# EAGLE design ESP12+mosfet+1117 (EAGLE 7.6.0)
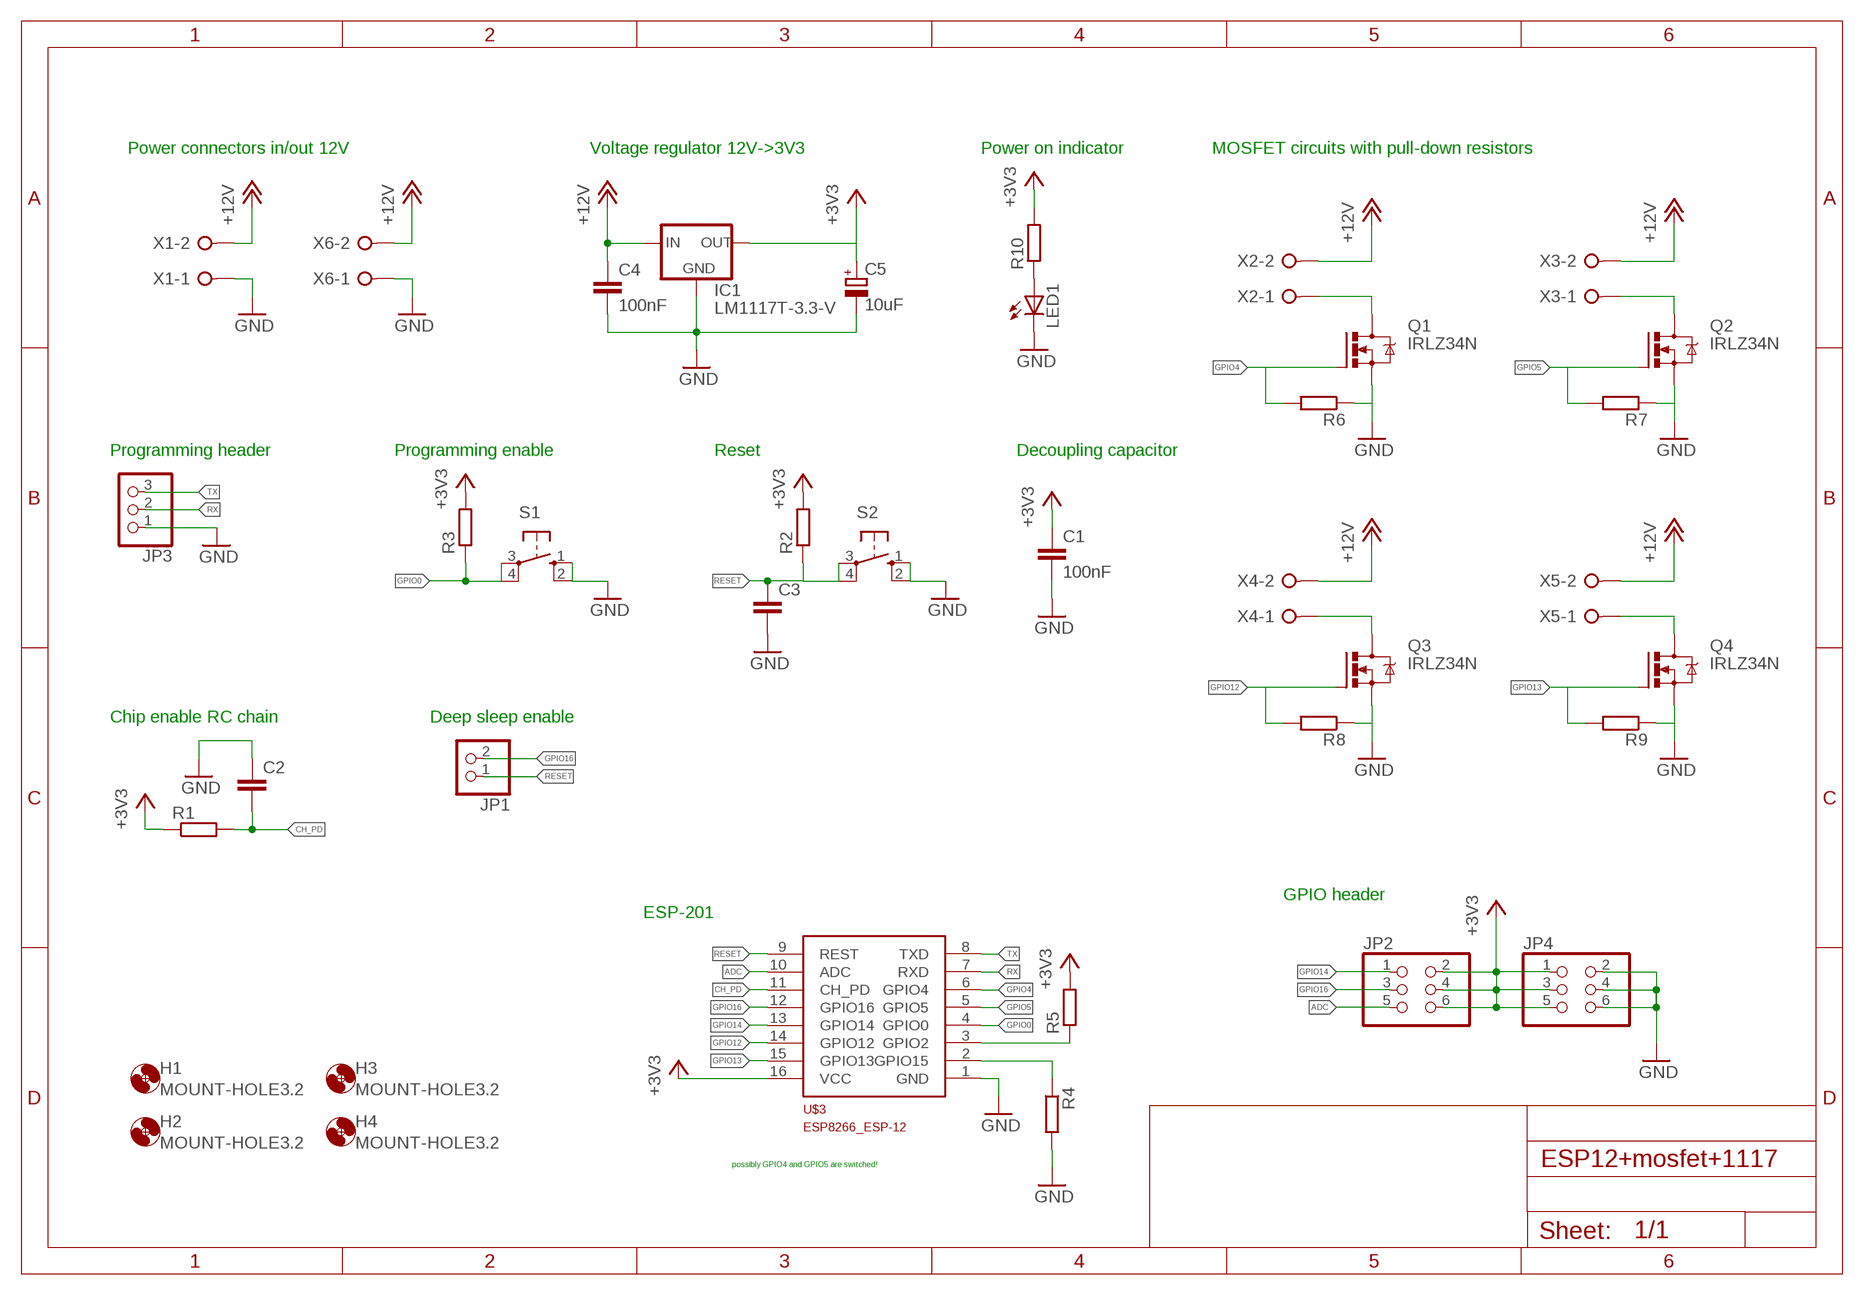
[diagram p0: schematic, sheet 1]

## Parts
C1  100nF  C-EUC0805  [C0805]
C2  C-EUC0805  [C0805]
C3  C-EUC0805  [C0805]
C4  100nF  C-EUC0805  [C0805]
C5  10uF  CPOL-EUE2-4  [E2-4]
H1  MOUNT-HOLE3.2  [3,2]
H2  MOUNT-HOLE3.2  [3,2]
H3  MOUNT-HOLE3.2  [3,2]
H4  MOUNT-HOLE3.2  [3,2]
IC1  LM1117T-3.3-V  [TO220V]
JP1  PINHD-1X2  [1X02]
JP2  PINHD-2X3  [2X03]
JP3  PINHD-1X3  [1X03]
JP4  PINHD-2X3  [2X03]
LED1  LED3MM  [LED3MM]
Q1  IRLZ34N  IRLZ44ZTO220BV  [TO220BV]
Q2  IRLZ34N  IRLZ44ZTO220BV  [TO220BV]
Q3  IRLZ34N  IRLZ44ZTO220BV  [TO220BV]
Q4  IRLZ34N  IRLZ44ZTO220BV  [TO220BV]
R1  R-EU_R0805  [R0805]
R2  R-EU_R0805  [R0805]
R3  R-EU_R0805  [R0805]
R4  R-EU_R0805  [R0805]
R5  R-EU_R0805  [R0805]
R6  R-EU_R0805  [R0805]
R7  R-EU_R0805  [R0805]
R8  R-EU_R0805  [R0805]
R9  R-EU_R0805  [R0805]
R10  R-EU_0207/10  [0207/10]
S1  10-XX  [B3F-10XX]
S2  10-XX  [B3F-10XX]
U$3  ESP8266_ESP-12  [ESP8266-ESP12]
X1  W237-02P  [W237-132]
X2  W237-02P  [W237-132]
X3  W237-02P  [W237-132]
X4  W237-02P  [W237-132]
X5  W237-02P  [W237-132]
X6  W237-02P  [W237-132]

## Nets
+3V3: C1.1 C5.+ IC1.2(OUT) JP2.2 JP2.4 JP2.6 JP4.1 JP4.3 JP4.5 R1.1 R2.2 R3.2 R5.2 R10.2 U$3.16(VCC)
+12V: C4.1 IC1.3(IN) X1.2 X2.2 X3.2 X4.2 X5.2 X6.2
ADC: JP2.5 U$3.10(ADC)
CH_PD: C2.2 R1.2 U$3.11(CH_PD)
GND: C1.2 C2.1 C3.2 C4.2 C5.- IC1.1(GND) JP3.1 JP4.2 JP4.4 JP4.6 LED1.K(C) Q1.S Q2.S Q3.S Q4.S R4.2 R6.1 R7.1 R8.1 R9.1 S1.1(S) S1.2(S1) S2.1(S) S2.2(S1) U$3.1(GND) X1.1 X6.1
GPIO0: R3.1 S1.3(P) S1.4(P1) U$3.4(GPIO0)
GPIO1: R5.1 U$3.3(GPIO2)
GPIO4: Q1.G R6.2 U$3.6(GPIO4)
GPIO5: Q2.G R7.2 U$3.5(GPIO5)
GPIO12: Q3.G R8.2 U$3.14(GPIO12)
GPIO13: Q4.G R9.2 U$3.15(GPIO13)
GPIO14: JP2.1 U$3.13(GPIO14)
GPIO15: R4.1 U$3.2(GPIO15)
GPIO16: JP1.2 JP2.3 U$3.12(GPIO16)
N$1: LED1.A R10.1
N$2: Q1.D X2.1
N$3: Q2.D X3.1
N$4: Q3.D X4.1
N$5: Q4.D X5.1
RESET: C3.1 JP1.1 R2.1 S2.3(P) S2.4(P1) U$3.9(REST)
RX: JP3.2 U$3.7(RXD)
TX: JP3.3 U$3.8(TXD)

## Notes on the sheet
- Power connectors in/out 12V | Voltage regulator 12V->3V3 | Power on indicator | MOSFET circuits with pull-down resistors
- Programming header | Programming enable | Reset | Decoupling capacitor
- Chip enable RC chain | Deep sleep enable
- GPIO header
- ESP-201
- possibly GPIO4 and GPIO5 are switched!

## Library data of the parts
C1-C4 = rcl:C-EU: CAPACITOR, European symbol
C5 = resistor:CPOL-EU: POLARIZED CAPACITOR, European symbol
H1-H4 = holes:MOUNT-HOLE: MOUNTING HOLE with drill center marker
IC1 = lm1117:LM1117T-*
JP1 = pinhead:PINHD-1X2: PIN HEADER
JP2 JP4 = pinhead:PINHD-2X3: PIN HEADER
JP3 = pinhead:PINHD-1X3: PIN HEADER
LED1 = led:LED: LED OSRAM: - CHIPLED LG R971, LG N971, LY N971, LG Q971, LY Q971, LO R971, LY R971 LH N974, LH R974 LS Q976, LO Q976, LY Q976 LO Q996 - Hyper CHIPLED LW Q18S LB Q993, LB Q99A, LB R99A - SideLED LS A670, LO A670, LY A670, LG A670, LP A670 LB A673, LV A673, LT A673, LW A673 LH A674 LY A675 LS A676, LA A676, LO A676, LY A676, LW A676 LS A679, LY A679, LG A679 - Hyper Micro SIDELED® LS Y876, LA Y876, LO Y876, LY Y876 LT Y87S - SmartLED LW L88C, LW L88S LB L89C, LB L89S, LG L890 LS L89K, LO L89K, LY L89K LS L896, LA L896, LO L896, LY L896 - TOPLED LS T670, LO T670, LY T670, LG T670, LP T670 LSG T670, LSP T670, LSY T670, LOP T670, LYG T670 LG T671, LOG T671, LSG T671 LB T673, LV T673, LT T673, LW T673 LH T674 LS T676, LA T676, LO T676, LY T676, LB T676, LH T676, LSB T676, LW T676 LB T67C, LV T67C, LT T67C, LS T67K, LO T67K, LY T67K, LW E67C LS E67B, LA E67B, LO E67B, LY E67B, LB E67C, LV E67C, LT E67C LW T67C LS T679, LY T679, LG T679 LS T770, LO T770, LY T770, LG T770, LP T770 LB T773, LV T773, LT T773, LW T773 LH T774 LS E675, LA E675, LY E675, LS T675 LS T776, LA T776, LO T776, LY T776, LB T776 LHGB T686 LT T68C, LB T68C - Hyper Mini TOPLED® LB M676 - Mini TOPLED Santana® LG M470 LS M47K, LO M47K, LY M47K Source: http://www.osram.convergy.de LUXEON: - LUMILED® LXK2-PW12-R00, LXK2-PW12-S00, LXK2-PW14-U00, LXK2-PW14-V00 LXK2-PM12-R00, LXK2-PM12-S00, LXK2-PM14-U00 LXK2-PE12-Q00, LXK2-PE12-R00, LXK2-PE12-S00, LXK2-PE14-T00, LXK2-PE14-U00 LXK2-PB12-K00, LXK2-PB12-L00, LXK2-PB12-M00, LXK2-PB14-N00, LXK2-PB14-P00, LXK2-PB14-Q00 LXK2-PR12-L00, LXK2-PR12-M00, LXK2-PR14-Q00, LXK2-PR14-R00 LXK2-PD12-Q00, LXK2-PD12-R00, LXK2-PD12-S00 LXK2-PH12-R00, LXK2-PH12-S00 LXK2-PL12-P00, LXK2-PL12-Q00, LXK2-PL12-R00 Source: www.luxeon.com KINGBRIGHT: KA-3528ASYC Source: www.kingbright.com
Q1-Q4 = transistor-power:IRLZ44Z: N-Channel HEXFET® Power MOSFET Logic Level AUTOMOTIVE MOSFET Source: http://www.irf.com/product-info/datasheets/data/irlz44zpbf.pdf
R1-R10 = resistor:R-EU_: RESISTOR, European symbol
S1 S2 = switch-omron:10-XX: OMRON SWITCH; MPN: B3F-1000; OC_FARNELL: 176432; OC_NEWARK: 36M3542
U$3 = ESP8266-ESP12:ESP8266_ESP-12
X1-X6 = con-wago-508:W237-02P: WAGO SREW CLAMP; OC_FARNELL: unknown; OC_NEWARK: unknown

## Board
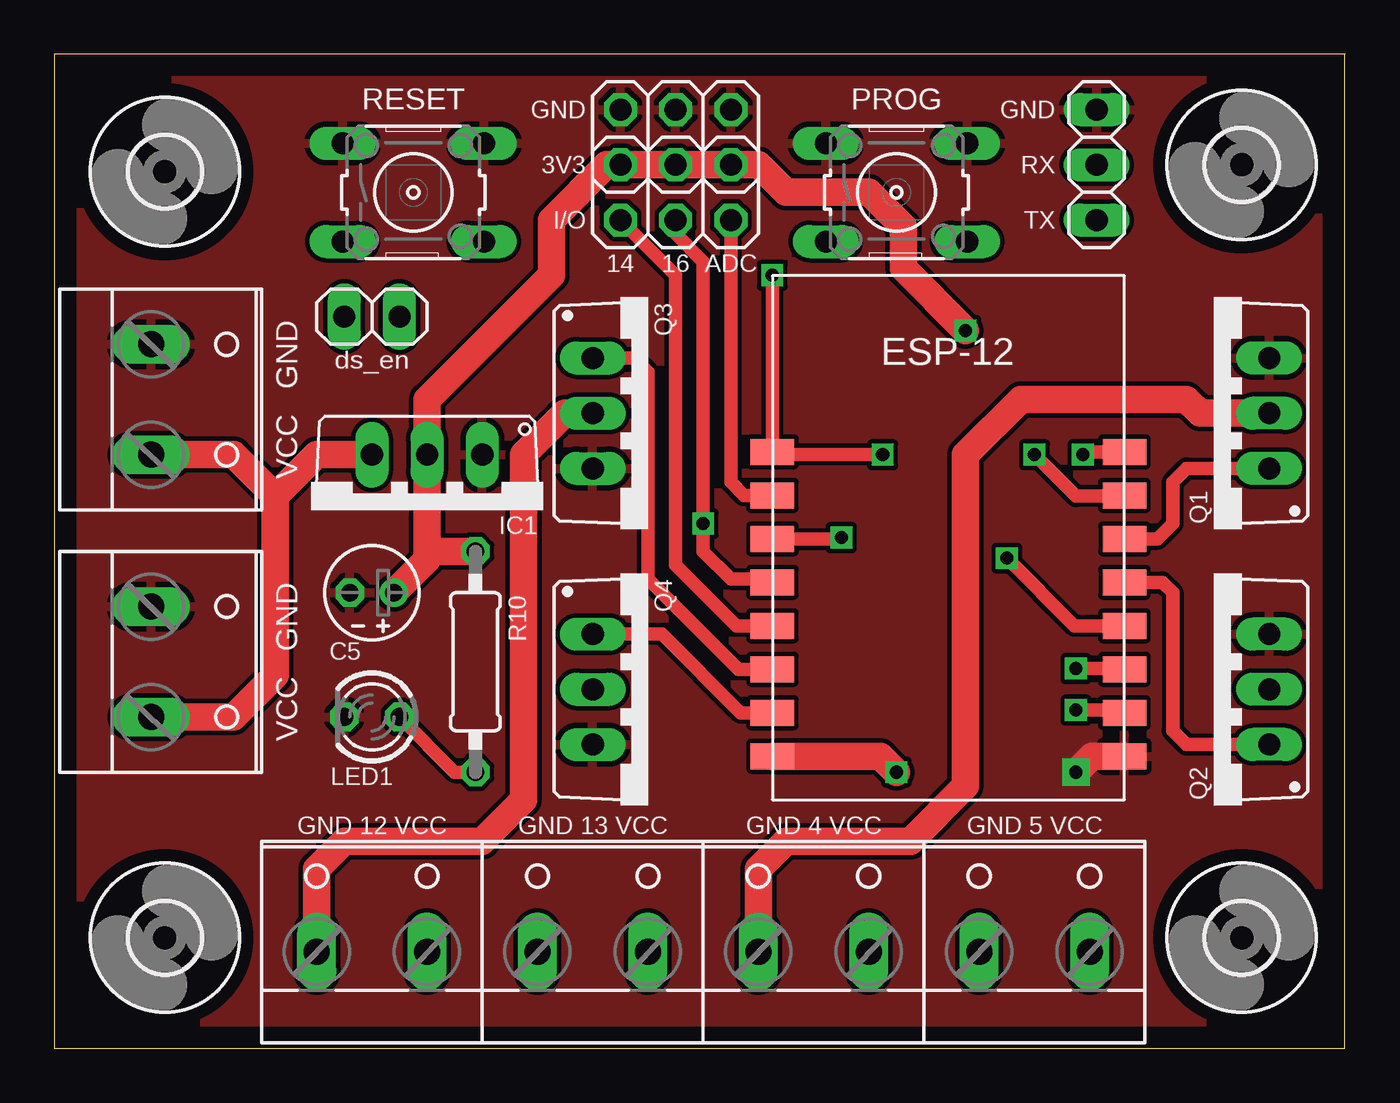
[diagram p1: board, top side]
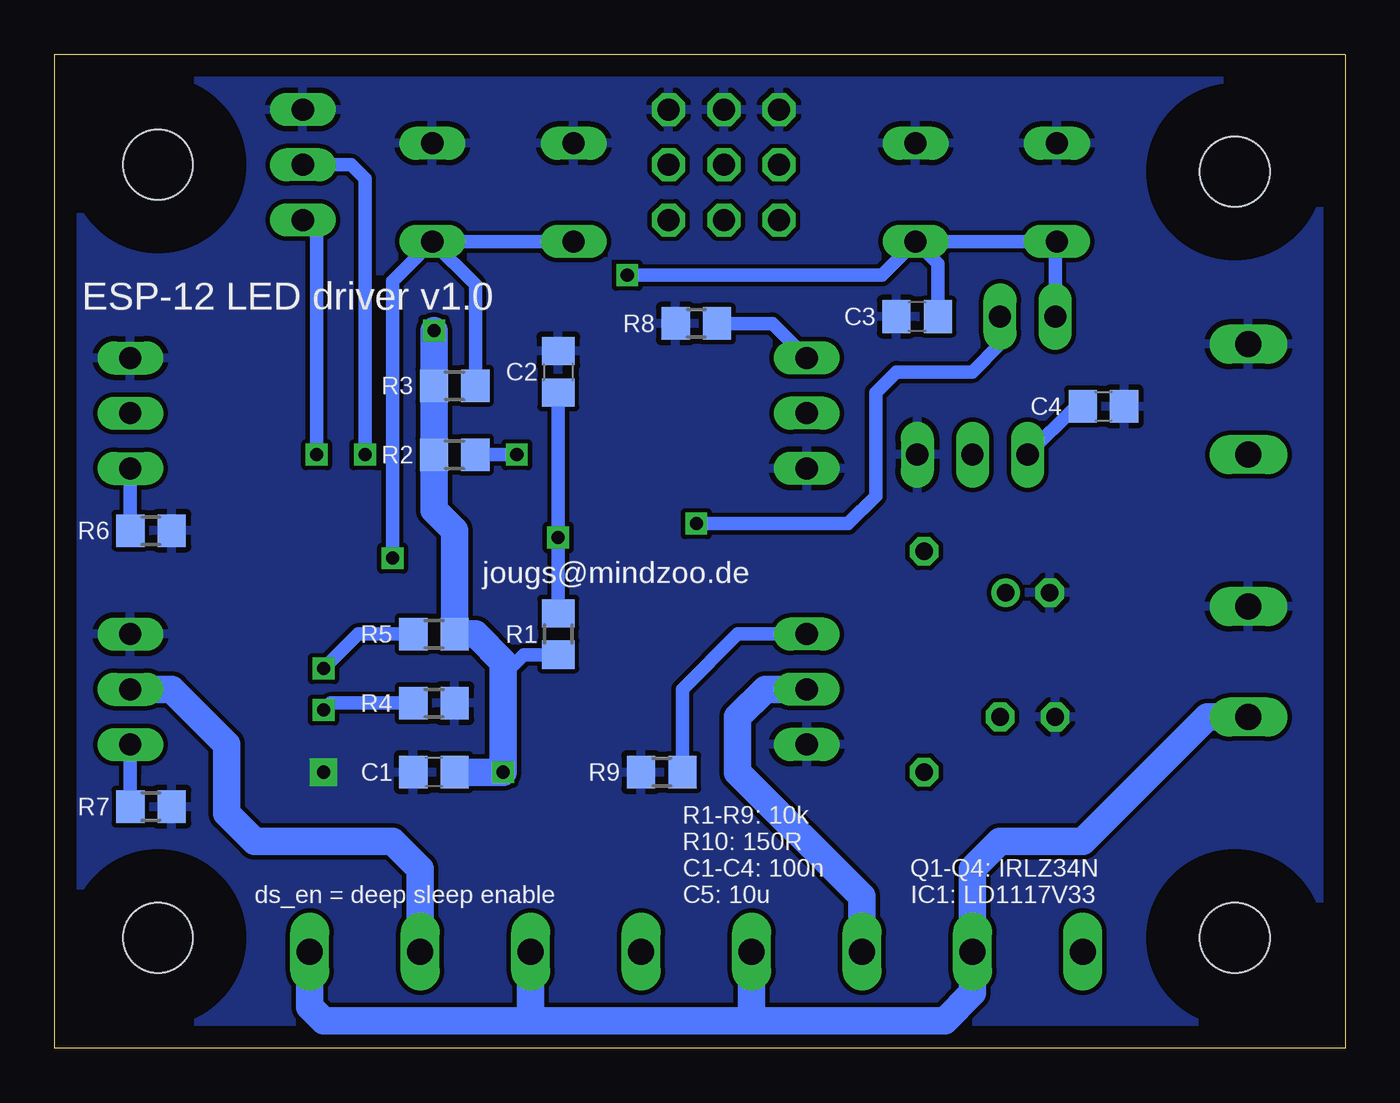
[diagram p2: board, bottom side, seen from below]

Size 59.37 x 45.72 mm. Coordinates in mm from the lower left corner, seen from the top.
Outline: 59.36,45.71 59.36,0 0,0 0,45.71
Outline: 59.37,45.72 0,45.72
Copper layers (1*16): Top 0.035mm / dielectric 1.5mm / Bottom 0.035mm
Design rules "default": minimum track width 10mil, minimum drill 24mil, track to track 8mil, track to pad 8mil, pad to pad 8mil, via to via 8mil, smd to smd 8mil, copper to edge 40mil, drill to drill 8mil, minimum pad ring 10mil, minimum via ring 8mil, stop-mask expansion 4mil, vias tented up to drill 0mil, thermal gap 10mil

### Footprints (pad centres in the part's own frame; a part is rotated, then mirrored left to right if it is on the bottom)
C0805 = smd 1.3 x 1.5: 1 -0.95,0; 2 0.95,0
E2-4 = drill 0.813 pad 1.27: + -1.016,0 | drill 0.813 pad 1.27 octagon: - 1.016,0
3,2 = hole 3.2: 0,0
TO220V = drill 1.016 long: 1 -2.54,-2.54; 2 0,-2.54; 3 2.54,-2.54
1X02 = drill 1.016 long: 1 -1.27,0; 2 1.27,0
2X03 = drill 1.016 octagon: 1 -2.54,-1.27; 2 -2.54,1.27; 3 0,-1.27; 4 0,1.27; 5 2.54,-1.27; 6 2.54,1.27
1X03 = drill 1.016 long: 1 -2.54,0; 2 0,0; 3 2.54,0
LED3MM = drill 0.813 octagon: A -1.27,0; K 1.27,0
TO220BV = drill 1.016 long: D 0,-2.54; G -2.54,-2.54; S 2.54,-2.54
R0805 = smd 1.3 x 1.5: 1 -0.95,0; 2 0.95,0
0207/10 = drill 0.813 octagon: 1 -5.08,0; 2 5.08,0
B3F-10XX = drill 1.016 long: 1 -3.251,2.261; 2 3.251,2.261; 3 -3.251,-2.261; 4 3.251,-2.261
ESP8266-ESP12 = smd 2 x 1.2: 1 16.2,2; 2 16.2,4; 3 16.2,6; 4 16.2,8; 5 16.2,10; 6 16.2,12; 7 16.2,14; 8 16.2,16; 9 0,16; 10 0,14; 11 0,12; 12 0,10; 13 0,8; 14 0,6; 15 0,4; 16 0,2
W237-132 = drill 1.194 long: 1 -2.54,-0.635; 2 2.54,-0.635

### Placement (x,y rotation side)
C1  41.91,12.7 180 bottom
C2  36.2,31.11 270 bottom
C3  19.68,33.66 180 bottom
C4  11.11,29.53 0 bottom
C5  14.61,20.95 180 top
H1  54.61,5.08 0 top
H2  5.08,5.08 0 top
H3  54.61,40.64 0 top
H4  5.08,40.32 0 top
IC1  17.14,24.77 180 top
JP1  14.61,33.66 0 top
JP2  28.57,39.37 0 top
JP3  47.94,40.64 270 top
JP4  28.57,41.91 0 top
LED1  14.61,15.24 180 top
Q1  53.34,29.21 90 top
Q2  53.34,16.51 90 top
Q3  27.3,29.21 270 top
Q4  27.3,16.51 270 top
R1  36.2,19.05 90 bottom
R2  40.96,27.3 180 bottom
R3  40.96,30.48 180 bottom
R4  41.91,15.88 0 bottom
R5  41.91,19.05 0 bottom
R6  54.93,23.81 180 bottom
R7  54.93,11.11 180 bottom
R8  29.84,33.34 0 bottom
R9  31.43,12.7 0 bottom
R10  19.37,17.78 90 top
S1  38.73,39.37 0 top
S2  16.51,39.37 0 top
U$3  33.02,11.43 0 top
X1  5.08,29.84 270 top
X2  34.92,5.08 0 top
X3  45.09,5.08 0 top
X4  14.61,5.08 0 top
X5  24.77,5.08 0 top
X6  5.08,17.78 270 top

### Tracks (layer width: path | path; a pad name or v marks a point on that pad's centre or on a via)
+3V3  (via drill 0.6)
  Top 1.27: U$3.16 38.01,13.43 v38.73,12.7 | v41.91,33.02 39.05,35.88 39.05,37.78 37.47,39.37 33.66,39.37 32.38,40.64 JP4.5 JP4.3 JP2.2 25.4,40.64 22.86,38.1 22.86,35.56 17.14,29.84 IC1.2 17.14,22.86 | 17.14,22.86 17.14,22.48 C5.+ | R10.2 17.14,22.86
  Bottom 0.61: R1.1 37.78,18.1 38.73,17.14
  Bottom 1.27: C1.1 v38.73,12.7 38.73,17.14 38.73,17.78 40.01,19.05 R5.2 40.95,22.54 40.95,23.81 41.91,24.77 R2.2 R3.2 v41.91,33.02
+12V
  Top 1.27: X1.2 8.26,27.3 10.16,25.4 | X6.2 8.26,15.24 10.16,17.14 10.16,25.4 | IC1.3 12.06,27.3 10.16,25.4
  Bottom 0.61: C4.1 12.38,29.53 IC1.3
  Bottom 1.27: 27.3,1.27 18.41,1.27 17.14,2.54 X4.2 17.14,8.26 15.88,9.53 12.06,9.53 6.35,15.24 X6.2 | 27.3,1.27 37.47,1.27 | 37.47,1.27 46.99,1.27 47.62,1.91 X3.2 | X2.2 37.47,1.27 | X5.2 27.3,1.27
ADC
  Top 0.61: U$3.10 31.72,25.43 31.11,26.04 JP2.5
CH_PD  (via drill 0.6 pad 1.02)
  Top 0.61: U$3.11 36.13,23.43 v36.2,23.5
  Bottom 0.61: R1.2 v36.2,23.5 C2.2
GND  (via drill 0.6 pad 1.27)
  Top 1.27: U$3.1 47.72,13.43 v46.99,12.7
  pour Bottom: 59.05,45.72 59.05,0 0,0 -0.64,46.35
  pour Top: -1.91,46.99 0,0 59.69,0 59.69,45.72
GPIO0  (via drill 0.6)
  Top 0.61: U$3.4 46.93,19.43 v43.81,22.54
  Bottom 0.61: v43.81,22.54 43.81,35.28 S1.4 | S1.4 S1.3 | R3.1 40.01,35.13 S1.4
GPIO1  (via drill 0.6)
  Top 0.61: v46.99,17.46 49.19,17.46 U$3.3
  Bottom 0.61: R5.1 45.4,19.05 v46.99,17.46
GPIO4
  Top 0.61: U$3.6 50.73,23.43 51.44,24.13 51.44,26.04 52.07,26.67 Q1.G
  Bottom 0.61: Q1.G R6.2
GPIO5
  Top 0.61: U$3.5 50.96,21.43 51.44,20.95 51.44,14.61 52.07,13.97 Q2.G
  Bottom 0.61: R7.2 55.88,12.7 Q2.G
GPIO12
  Top 0.61: U$3.14 31.46,17.43 27.3,21.59 27.3,31.11 26.67,31.75 Q3.G
  Bottom 0.61: R8.2 26.35,33.34 Q3.G
GPIO13
  Top 0.61: U$3.15 31.56,15.43 27.94,19.05 Q4.G
  Bottom 0.61: R9.2 30.48,16.51 27.94,19.05 26.36,19.05 Q4.G
GPIO14
  Top 0.61: U$3.13 31.37,19.43 28.57,22.23 28.57,35.56 JP2.1
GPIO15  (via drill 0.6)
  Top 0.61: v46.99,15.56 49.09,15.56 U$3.2
  Bottom 0.61: R4.1 46.67,15.88 v46.99,15.56
GPIO16  (via drill 0.6)
  Top 0.61: JP2.3 28.57,37.47 29.84,36.2 v29.84,24.13 29.84,22.86 31.11,21.59 32.86,21.59 U$3.12
  Bottom 0.61: v29.84,24.13 22.86,24.13 21.59,25.4 21.59,30.16 20.64,31.11 17.14,31.11 15.88,32.38 JP1.2
N$1
  Top 0.61: LED1.A 18.41,12.7 R10.1
N$2
  Top 1.27: Q1.D 52.7,29.21 52.07,29.84 44.45,29.84 41.91,27.3 41.91,12.06 39.37,9.53 33.66,9.53 32.38,8.26 X2.1
N$3
  Bottom 1.27: Q2.D 53.98,16.51 51.44,13.97 51.44,10.79 50.16,9.53 43.81,9.53 42.55,8.26 X3.1
N$4
  Top 1.27: X4.1 12.06,8.26 13.34,9.53 19.68,9.53 21.59,11.43 21.59,27.3 23.5,29.21 Q3.D
N$5
  Bottom 1.27: X5.1 22.23,6.99 27.94,12.7 27.94,15.24 26.67,16.51 Q4.D
RESET  (via drill 0.6)
  Top 0.61: v38.1,27.3 33.15,27.3 U$3.9 v33.02,35.56
  Bottom 0.61: R2.1 v38.1,27.3 | v33.02,35.56 21.31,35.56 S2.4 | S2.4 S2.3 13.34,36.55 JP1.1 | S2.4 18.73,36.08 C3.1
RX  (via drill 0.6)
  Top 0.61: U$3.7 48.92,25.43 48.9,25.4 46.99,25.4 v45.09,27.3
  Bottom 0.61: v45.09,27.3 45.09,40.01 45.72,40.64 JP3.2
TX  (via drill 0.6)
  Top 0.61: U$3.8 47.43,27.43 v47.31,27.3
  Bottom 0.61: v47.31,27.3 47.31,37.47 JP3.3

### Text on the board
tNames: RESET | GND | PROG | GND | 3V3 | RX | I/O | TX | 14 | 16 | ADC | ds_en | VCC GND | VCC GND | GND 12 VCC | GND 13 VCC | GND 4 VCC | GND 5 VCC
bNames: ESP-12 LED driver v1.0 | jougs@mindzoo.de | Q1-Q4: IRLZ34N / IC1: LD1117V33 | R1-R9: 10k / R10: 150R / C1-C4: 100n / C5: 10u | ds_en = deep sleep enable